# EAGLE design open-lux-N (EAGLE 6.5.0)
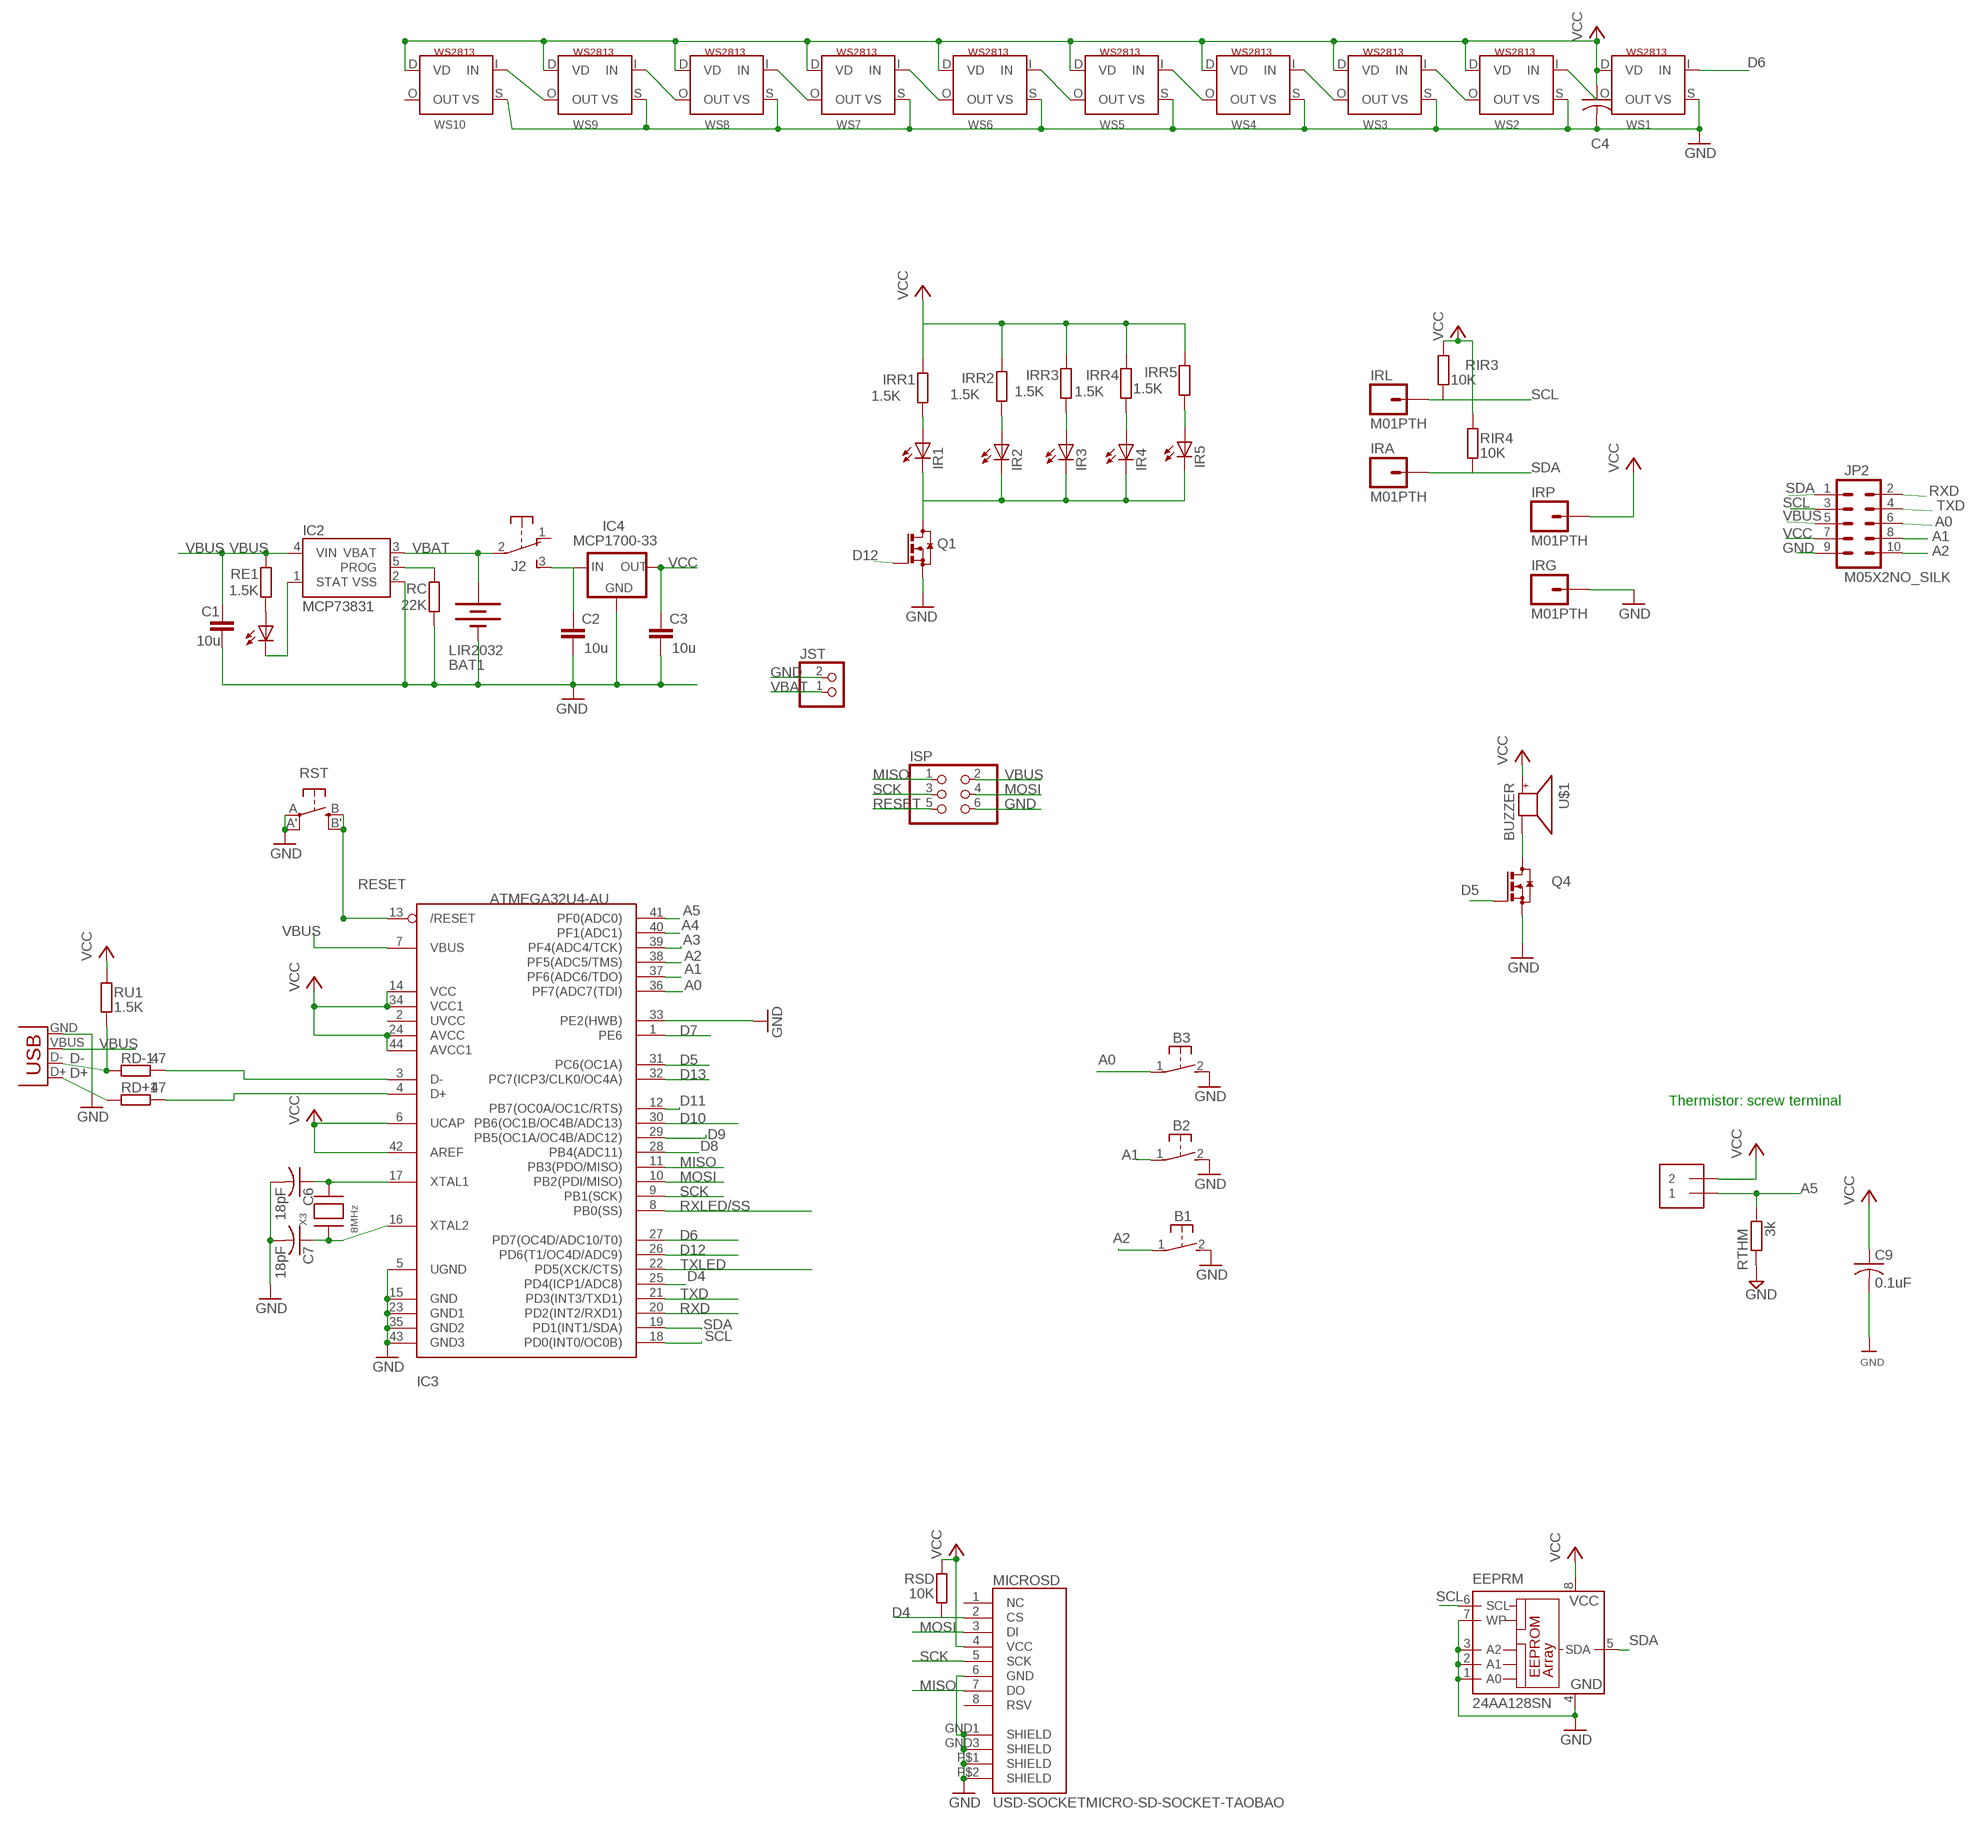
[diagram p0: schematic, sheet 1, part 1 of 2]
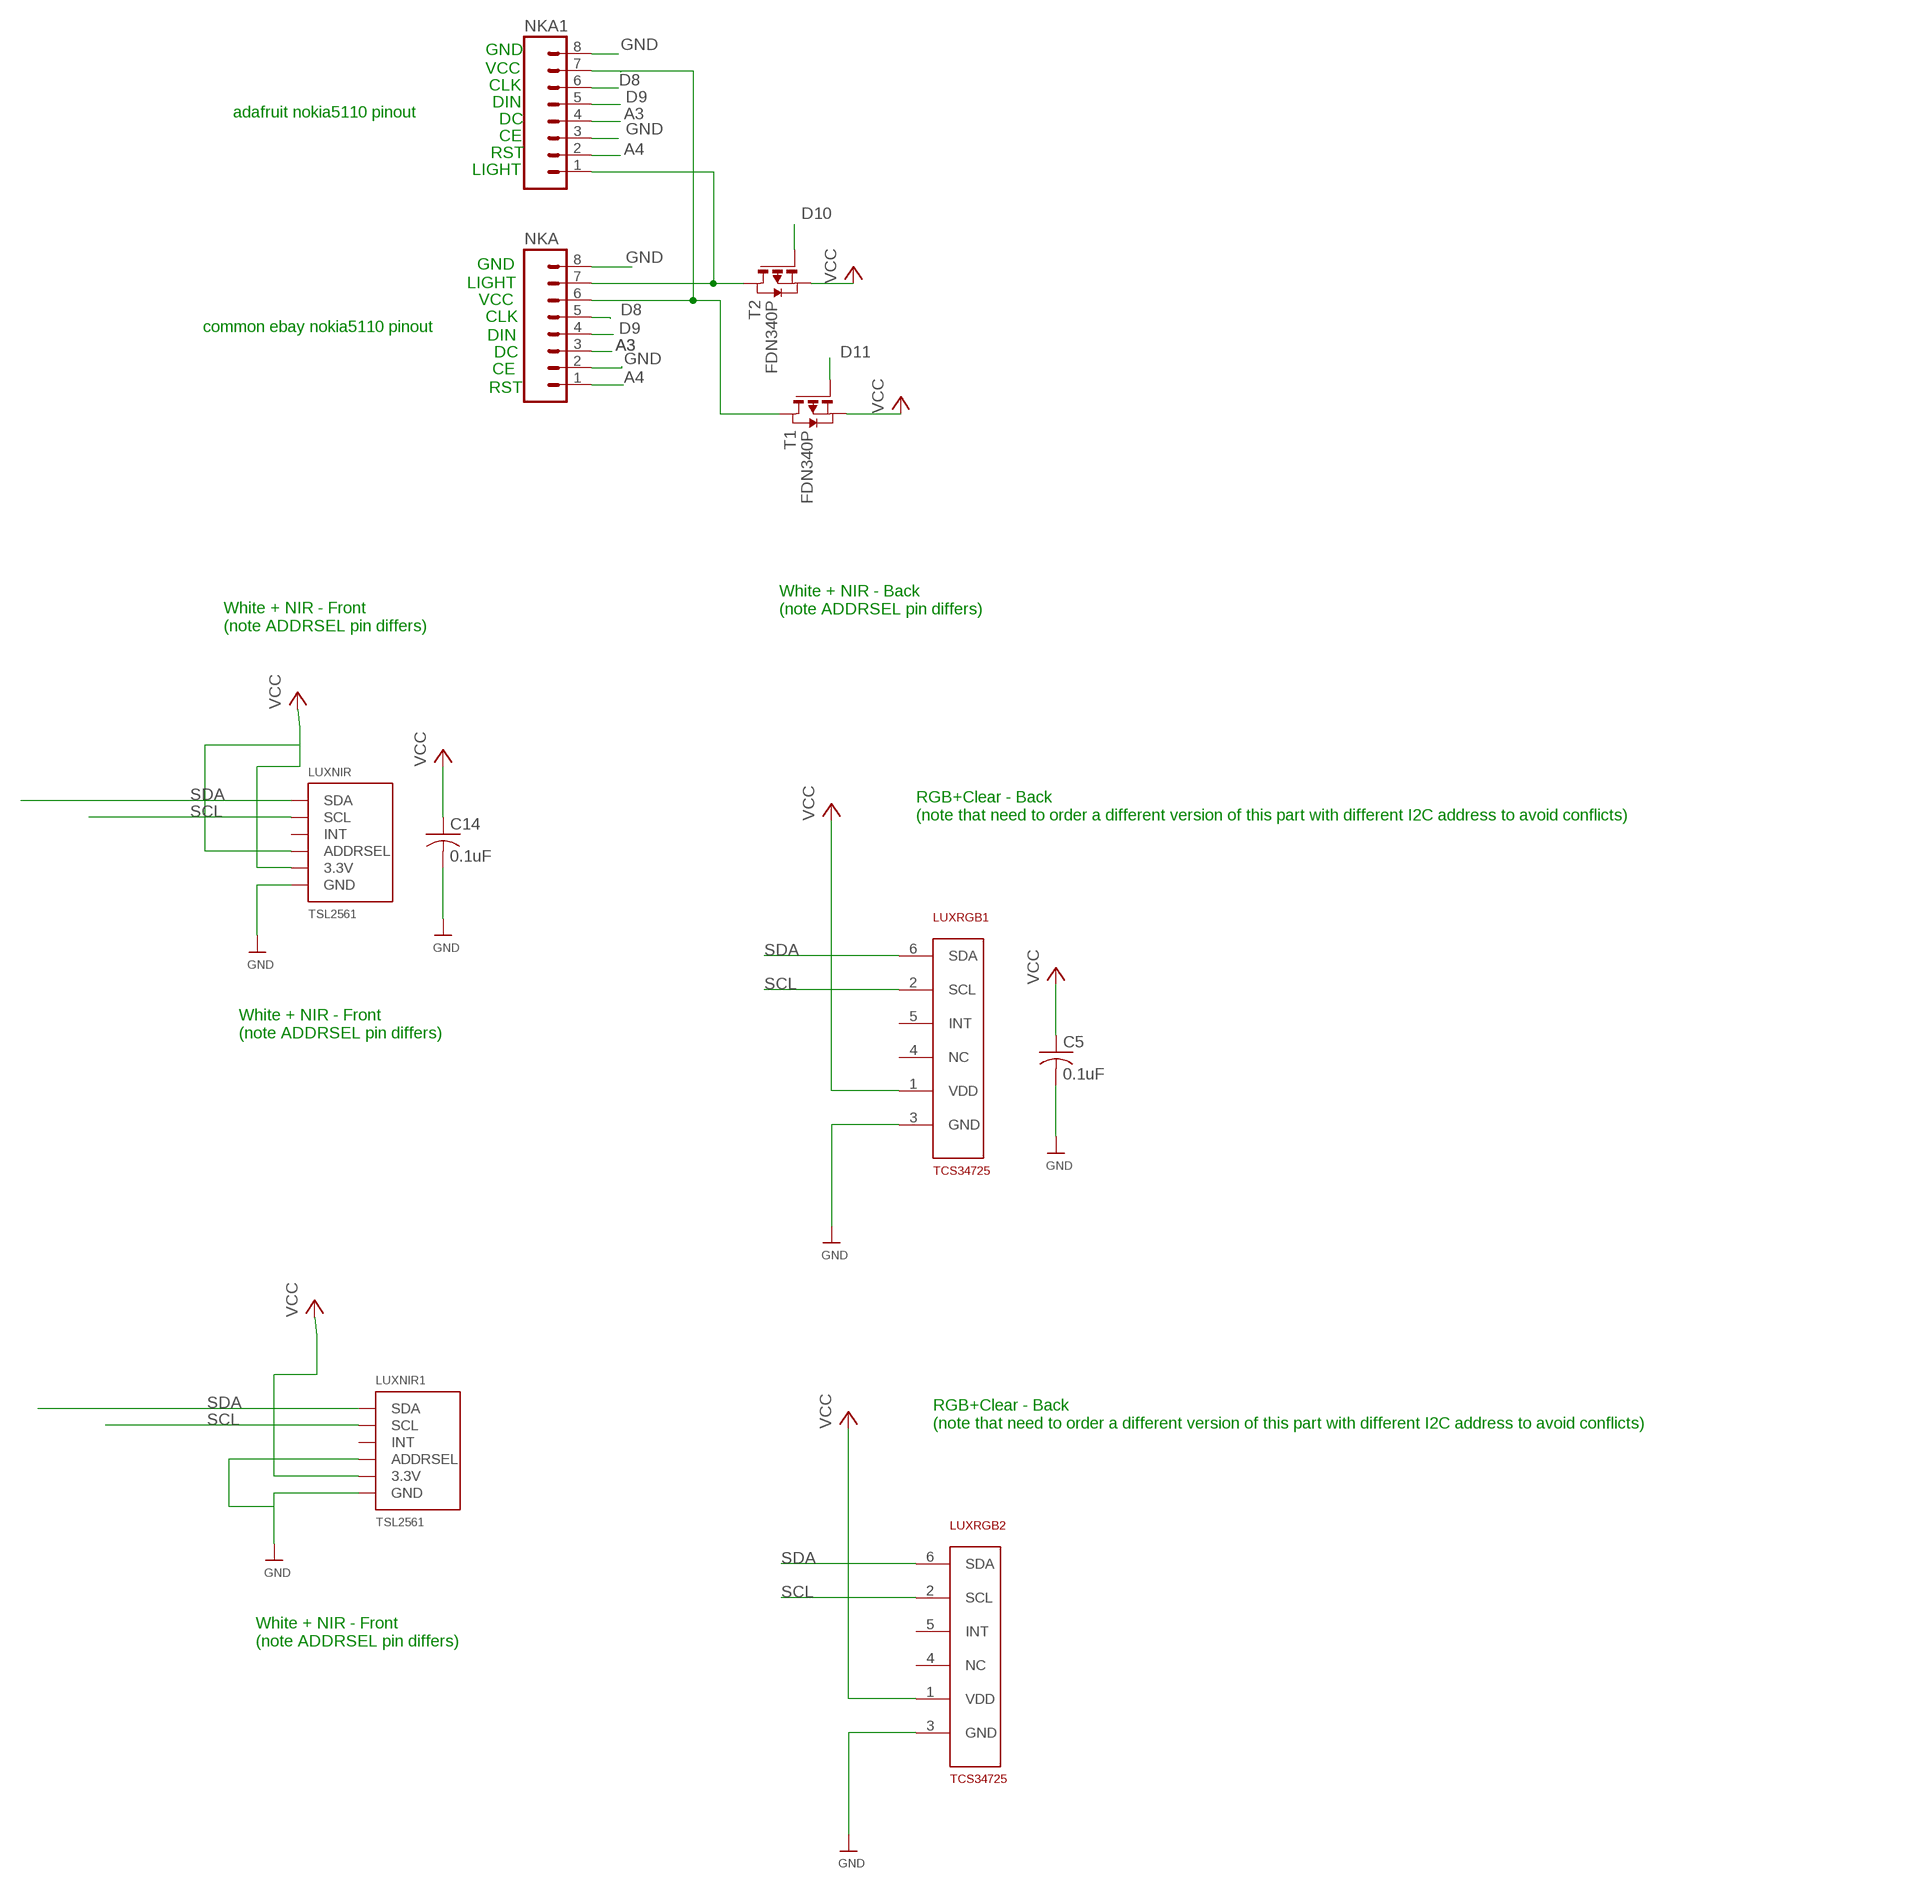
[diagram p1: schematic, sheet 1, part 2 of 2]

## Parts
B1  31-XX  [B3F-31XX]
B2  31-XX  [B3F-31XX]
B3  31-XX  [B3F-31XX]
BAT1  LIR2032  BATTERYBATTCOM_20MM_PTH_SMT  [BATTCOM_20MM_PTH_SMT]
C1  10u  C-EUC0805  [C0805]
C2  10u  C-EUC0805  [C0805]
C3  10u  C-EUC0805  [C0805]
C4  C-USC0805K  [C0805K]
C5  0.1uF  C-USC0805  [C0805]
C6  18pF  C-USC0805K  [C0805K]
C7  18pF  C-USC0805K  [C0805K]
C9  0.1uF  C-USC0805  [C0805]
C14  0.1uF  C-USC0805  [C0805]
CHARGE  0805  LEDCHIPLED_0805  [CHIPLED_0805]
EEPRM  24AA128SN  [SO-08]
IC2  MCP73831  [SOT23-5]
IC3  ATMEGA32U4-AU  [TQFP44]
IC4  MCP1700-33  MCP1700SOT233  [SOT23]
IR1  LEDCHIP-LED0603  [CHIP-LED0603]
IR2  LEDCHIP-LED0603  [CHIP-LED0603]
IR3  LEDCHIP-LED0603  [CHIP-LED0603]
IR4  LEDCHIP-LED0603  [CHIP-LED0603]
IR5  LEDCHIP-LED0603  [CHIP-LED0603]
IRA  M01PTH  [1X01]
IRG  M01PTH  [1X01]
IRL  M01PTH  [1X01]
IRP  M01PTH  [1X01]
IRR1  1.5K  R-EU_R0805  [R0805]
IRR2  1.5K  R-EU_R0805  [R0805]
IRR3  1.5K  R-EU_R0805  [R0805]
IRR4  1.5K  R-EU_R0805  [R0805]
IRR5  1.5K  R-EU_R0805  [R0805]
ISP  PINHD-2X3  [2X03]
J2  EG1206  [EG1206]
JP2  M05X2NO_SILK  [2X5_NOSILK]
JST  JST_2PIN-SMT-RA  [JST-PH-2-SMT-RA]
LUXNIR  TSL2561  [TSL2561_FN@1]
LUXNIR1  TSL2561  [TSL2561_FN@1]
LUXRGB1  TCS34725  [DFN-6]
LUXRGB2  TCS34725  [DFN-6]
MICROSD  USD-SOCKETMICRO-SD-SOCKET-TAOBAO  [MICRO-SD-SOCKET-TAOBAO]
NKA  M08LOCK  [1X08_LOCK]
NKA1  M08LOCK  [1X08_LOCK]
Q1  BSS123  [SOT23]
Q4  BSS123  [SOT23]
RC  22K  R-EU_R0805  [R0805]
RD+1  47  R-EU_R0805  [R0805]
RD-1  47  R-EU_R0805  [R0805]
RE1  1.5K  R-EU_R0805  [R0805]
RIR3  10K  R-EU_R0805  [R0805]
RIR4  10K  R-EU_R0805  [R0805]
RSD  10K  R-EU_R0805  [R0805]
RST  EVQQ2  [EVQ-Q2]
RTHM  3k  R-EU_0204/7  [0204/7]
RU1  1.5K  R-EU_R0805  [R0805]
T1  FDN340P  PMOSSOT23  [SOT-23]
T2  FDN340P  PMOSSOT23  [SOT-23]
THM1  1X2-3.5MM  [1X2-3.5MM]
U$1  BUZZER  [SMT-8585-BUZZER]
WS1  WS2813  [RGBLED5050_4]
WS2  WS2813  [RGBLED5050_4]
WS3  WS2813  [RGBLED5050_4]
WS4  WS2813  [RGBLED5050_4]
WS5  WS2813  [RGBLED5050_4]
WS6  WS2813  [RGBLED5050_4]
WS7  WS2813  [RGBLED5050_4]
WS8  WS2813  [RGBLED5050_4]
WS9  WS2813  [RGBLED5050_4]
WS10  WS2813  [RGBLED5050_4]
X2  USBSMD  [USB-MINIB]
X3  8MHz  XTALNX5032  [NX5032]

## Nets
A0: B3.1(P) IC3.36(PF7(ADC7(TDI)) JP2.6
A1: B2.1(P) IC3.37(PF6(ADC6/TDO)) JP2.8
A2: B1.1(P) IC3.38(PF5(ADC5/TMS)) JP2.10
A3: IC3.39(PF4(ADC4/TCK)) NKA1.4 NKA.3
A4: IC3.40(PF1(ADC1)) NKA1.2 NKA.1
A5: IC3.41(PF0(ADC0)) RTHM.2 THM1.1
D4: IC3.25(PD4(ICP1/ADC8)) MICROSD.2(CS) RSD.1
D5: IC3.31(PC6(OC1A)) Q4.1(G)
D6: IC3.27(PD7(OC4D/ADC10/T0)) WS1.I(IN)
D7: IC3.1(PE6)
D8: IC3.28(PB4(ADC11)) NKA1.6 NKA.5
D9: IC3.29(PB5(OC1A/OC4B/ADC12)) NKA1.5 NKA.4
D10: IC3.30(PB6(OC1B/OC4B/ADC13)) T2.3(G)
D11: IC3.12(PB7(OC0A/OC1C/RTS)) T1.3(G)
D12: IC3.26(PD6(T1/OC4D/ADC9)) Q1.1(G)
D13: IC3.32(PC7(ICP3/CLK0/OC4A))
D+: RD+1.1 X2.D+
D-: RD-1.1 RU1.1 X2.D-
GND: B1.2(S) B2.2(S) B3.2(S) BAT1.P$1(-) C1.2 C2.2 C3.2 C4.2 C5.2 C6.2 C7.2 C9.2 C14.2 EEPRM.1(A0) EEPRM.2(A1) EEPRM.3(A2) EEPRM.4(GND) EEPRM.7(WP) IC2.2(VSS) IC3.5(UGND) IC3.15(GND) IC3.23(GND1) IC3.33(PE2(HWB)) IC3.35(GND2) IC3.43(GND3) IC4.1(GND) IRG.1 ISP.6 JP2.9 JST.2 LUXNIR1.ADR(ADDRSEL) LUXNIR1.VSS(GND) LUXNIR.VSS(GND) LUXRGB1.3(GND) LUXRGB2.3(GND) MICROSD.6(GND) MICROSD.GND1(SHIELD) MICROSD.GND3(SHIELD) MICROSD.P$1(SHIELD) MICROSD.P$2(SHIELD) NKA1.3 NKA1.8 NKA.2 NKA.8 Q1.2(S) Q4.2(S) RC.1 RST.A'(P1) RST.A(P) RTHM.1 WS1.S(VS) WS2.S(VS) WS3.S(VS) WS4.S(VS) WS5.S(VS) WS6.S(VS) WS7.S(VS) WS8.S(VS) WS9.S(VS) WS10.S(VS) X2.GND
MISO: IC3.11(PB3(PDO/MISO)) ISP.1 MICROSD.7(DO)
MOSI: IC3.10(PB2(PDI/MISO)) ISP.4 MICROSD.3(DI)
N$1: C2.1 IC4.3(IN) J2.3(S)
N$2: C7.1 IC3.16(XTAL2) X3.P$1
N$3: C6.1 IC3.17(XTAL1) X3.P$2
N$4: WS9.O(OUT) WS10.I(IN)
N$5: CHARGE.C IC2.1(STAT)
N$6: IC2.5(PROG) RC.2
N$7: Q4.3(D) U$1.-
N$9: IR1.C IR2.C IR3.C IR4.C IR5.C Q1.3(D)
N$10: CHARGE.A RE1.1
N$11: IR1.A IRR1.1
N$12: NKA1.1 NKA.7 T2.1(D)
N$13: IR2.A IRR2.1
N$14: WS6.O(OUT) WS7.I(IN)
N$15: IR3.A IRR3.1
N$17: IR4.A IRR4.1
N$18: IR5.A IRR5.1
N$19: WS4.O(OUT) WS5.I(IN)
N$20: WS5.O(OUT) WS6.I(IN)
N$21: IC3.4(D+) RD+1.2
N$22: IC3.3(D-) RD-1.2
N$23: WS1.O(OUT) WS2.I(IN)
N$24: WS2.O(OUT) WS3.I(IN)
N$25: WS3.O(OUT) WS4.I(IN)
N$27: WS8.O(OUT) WS9.I(IN)
N$28: WS7.O(OUT) WS8.I(IN)
N$31: NKA1.7 NKA.6 T1.1(D)
RESET: IC3.13(/RESET) ISP.5 RST.B'(S1) RST.B(S)
RXD: IC3.20(PD2(INT2/RXD1)) JP2.2
RXLED/SS: IC3.8(PB0(SS))
SCK: IC3.9(PB1(SCK)) ISP.3 MICROSD.5(SCK)
SCL: EEPRM.6(SCL) IC3.18(PD0(INT0/OC0B)) IRL.1 JP2.3 LUXNIR1.CLK(SCL) LUXNIR.CLK(SCL) LUXRGB1.2(SCL) LUXRGB2.2(SCL) RIR3.1
SDA: EEPRM.5(SDA) IC3.19(PD1(INT1/SDA)) IRA.1 JP2.1 LUXNIR1.DATA(SDA) LUXNIR.DATA(SDA) LUXRGB1.6(SDA) LUXRGB2.6(SDA) RIR4.1
TXD: IC3.21(PD3(INT3/TXD1)) JP2.4
TXLED: IC3.22(PD5(XCK/CTS))
VBAT: BAT1.P$2(+) IC2.3(VBAT) J2.2(P) JST.1
VBUS: C1.1 IC2.4(VIN) IC3.7(VBUS) ISP.2 JP2.5 RE1.2 X2.VBUS
VCC: C3.1 C4.1 C5.1 C9.1 C14.1 EEPRM.8(VCC) IC3.6(UCAP) IC3.14(VCC) IC3.24(AVCC) IC3.34(VCC1) IC3.42(AREF) IC3.44(AVCC1) IC4.2(OUT) IRP.1 IRR1.2 IRR2.2 IRR3.2 IRR4.2 IRR5.2 JP2.7 LUXNIR1.VDD(3.3V) LUXNIR.ADR(ADDRSEL) LUXNIR.VDD(3.3V) LUXRGB1.1(VDD) LUXRGB2.1(VDD) MICROSD.4(VCC) RIR3.2 RIR4.2 RSD.2 RU1.2 T1.2(S) T2.2(S) THM1.2 U$1.+ WS1.D(VD) WS2.D(VD) WS3.D(VD) WS4.D(VD) WS5.D(VD) WS6.D(VD) WS7.D(VD) WS8.D(VD) WS9.D(VD) WS10.D(VD)
Unconnected: IC3.2(UVCC) J2.1(O) LUXNIR1.INT LUXNIR.INT LUXRGB1.4(NC) LUXRGB1.5(INT) LUXRGB2.4(NC) LUXRGB2.5(INT) MICROSD.1(NC) MICROSD.8(RSV) WS10.O(OUT)

## Notes on the sheet
- GND
- VCC
- CLK
- adafruit nokia5110 pinout | DIN
- DC
- CE
- RST
- LIGHT
- GND
- LIGHT
- VCC
- common ebay nokia5110 pinout | CLK
- DIN
- DC
- CE
- RST
- White + NIR - Back
  (note ADDRSEL pin differs)
- White + NIR - Front
  (note ADDRSEL pin differs)
- RGB+Clear - Back 
  (note that need to order a different version of this part with different I2C address to avoid conflicts)
- White + NIR - Front
  (note ADDRSEL pin differs)
- Thermistor: screw terminal
- RGB+Clear - Back 
  (note that need to order a different version of this part with different I2C address to avoid conflicts)
- White + NIR - Front
  (note ADDRSEL pin differs)

## Library data of the parts
B1-B3 = adafruit:31-XX: OMRON SWITCH Now with beefier pads!
BAT1 = SparkFunNew:BATTERY: Battery Holders Various common sizes : AA, AAA, 20mm coin cell and 12mm coin cell.
C1-C3 = resistor:C-EU: CAPACITOR, European symbol
C4 = adafruit2013:C-US: CAPACITOR, American symbol
C5-C7 C9 C14 = adafruit:C-US: CAPACITOR, American symbol
CHARGE = led:LED: LED
EEPRM = microchip:24*: Serial EEPROM I2C; MF: MICROCHIP; MPN: 24AA128-I/SN; OC_FARNELL: unknown; OC_NEWARK: 92C6842
IC2 = SparkFunNew:MCP73831: Microchip's MCP73831 Miniature single cell, fully integrated Li-Ion, Li-polymer charge management controller http://ww1.microchip.com/downloads/en/DeviceDoc/21984a.pdf
IC3 = adaprog:ATMEGA32U4
IC4 = adafruit:MCP1700: VOLTAGE REGULATOR
IR1-IR5 = adafruit:LED: LED
IRA IRG IRL IRP = SparkFun-Connectors:M01: Header 1 Standard 1-pin 0.1" header. Use with straight break away headers (SKU : PRT-00116), right angle break away headers (PRT-00553), swiss pins (PRT-00743), machine pins (PRT-00117), and female headers (PRT-00115).
IRR1-IRR5 RC RD+1 RD-1 RE1 RIR3 RIR4 RSD RTHM RU1 = rcl:R-EU_: RESISTOR, European symbol
ISP = pinhead:PINHD-2X3: PIN HEADER
J2 = adafruit:EG1206
JP2 = SparkFun-Connectors:M05X2: Header 5x2 Standard 10-pin dual row 0.1" header. Commonly used with AVR-ISP. Use with Spark Fun Electronics SKU: PRT-00778
JST = adafruit:JST_2PIN: JST 2-Pin Connectors of various flavors SMT-RA (S2B-PH-SM4) 4UConnector #17311 SMT (B2B-PH-SM4) THM-RA (S2B-PH) THM (B2B-PH)
LUXNIR LUXNIR1 = microbuilder:TSL2561: TSL2561 Light-To-Digital Sensor Mouser Part Numbers: CS (obsolete): 856-TSL2561CS DFN (cheapest): 856-TSL2561FN
LUXRGB1 LUXRGB2 = dwbLibrary:TCS34725
MICROSD = SparkFunNew:USD-SOCKET: microSD Socket Push-push type uSD socket. Schematic element and footprint production proven. Spark Fun Electronics SKU : PRT-00127. tDoc lines correctly indicate media card edge positions when inserting (unlocked, locked, depressed).
NKA NKA1 = SparkFun-Connectors:M08: Header 8 Standard 8-pin 0.1" header. Use with straight break away headers (SKU : PRT-00116), right angle break away headers (PRT-00553), swiss pins (PRT-00743), machine pins (PRT-00117), and female headers (PRT-00115).
Q1 Q4 = transistor-small-signal:BSS123: N-CHANNEL MOS FET
RST = adafruit:EVQQ2: SMT 6mm switch, EVQQ2 series http://www.ladyada.net/library/eagle
T1 T2 = zetex:PMOSSOT23: MOS FET
THM1 = adafruit:1X2: 3.5mm Terminal block http://www.ladyada.net/library/pcb/eaglelibrary.html
U$1 = adafruit:BUZZER
WS1-WS10 = adafruit:WS2813
X2 = SparkFun:USB: USB Connectors USB-B-PTH is fully proven SKU : PRT-00139 USB-miniB is fully proven SKU : PRT-00587 USB-A-PCB is untested. USB-A-H is throughly reviewed, but untested. Spark Fun Electronics SKU : PRT-00437 USB-B-SMT is throughly reviewed, but untested. Needs silkscreen touching up. USB-A-S has not been used/tested USB-MB-H has not been used/tested
X3 = adaprog:XTAL

## Net classes
1 power: width 0.813 mm, clearance 0.203 mm

## Board
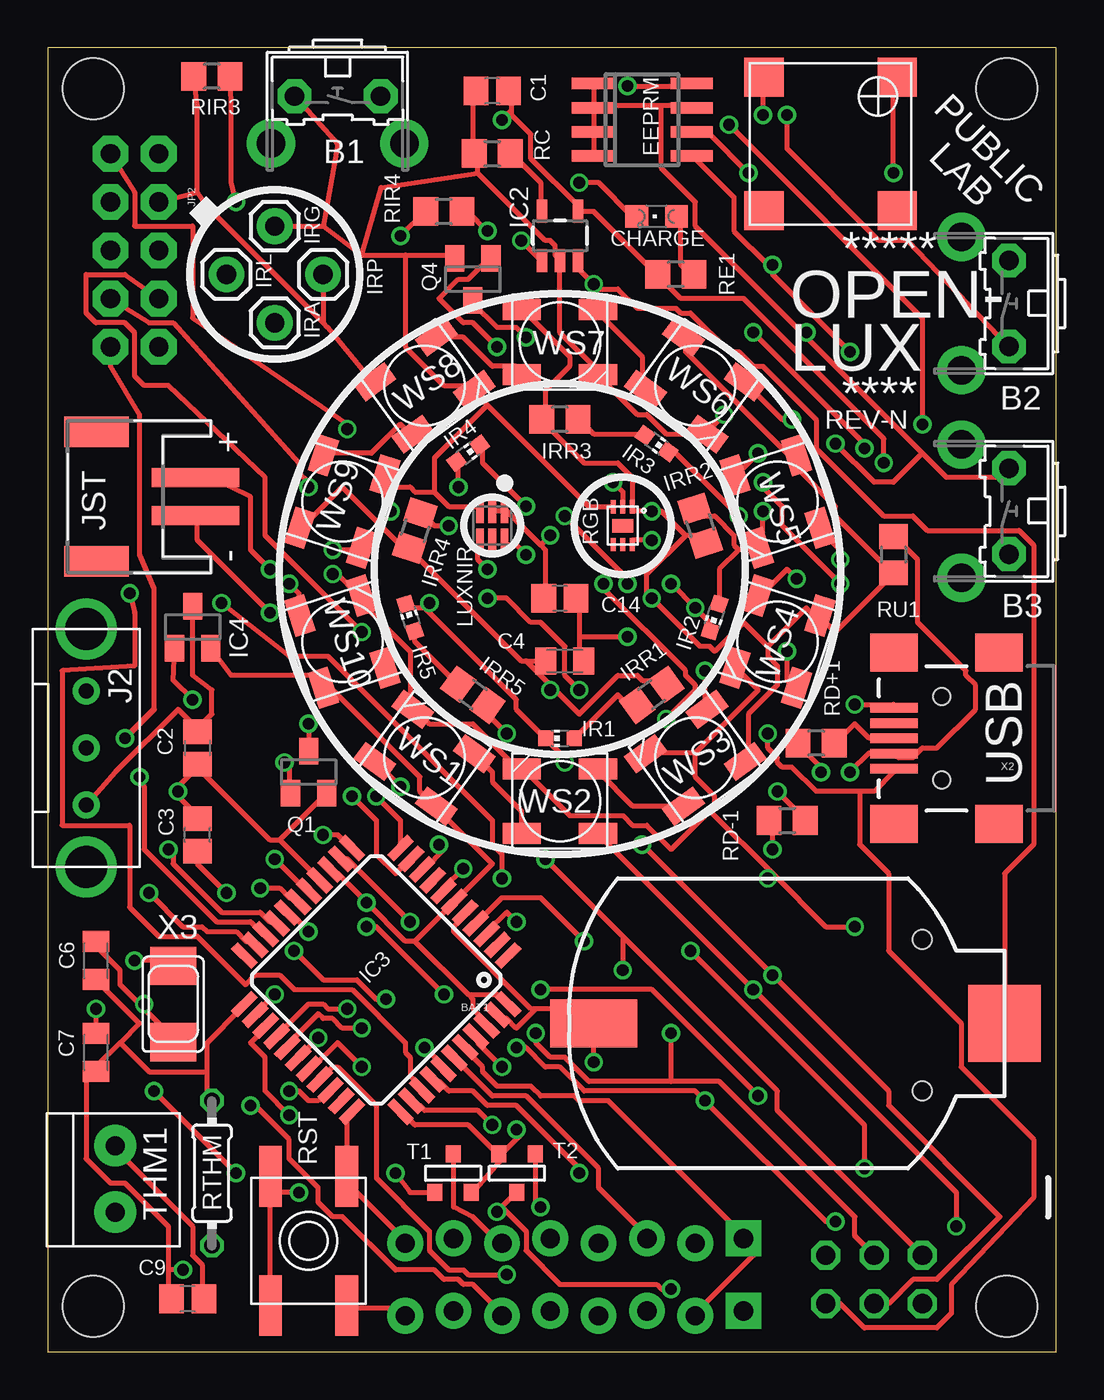
[diagram p2: board, top side]
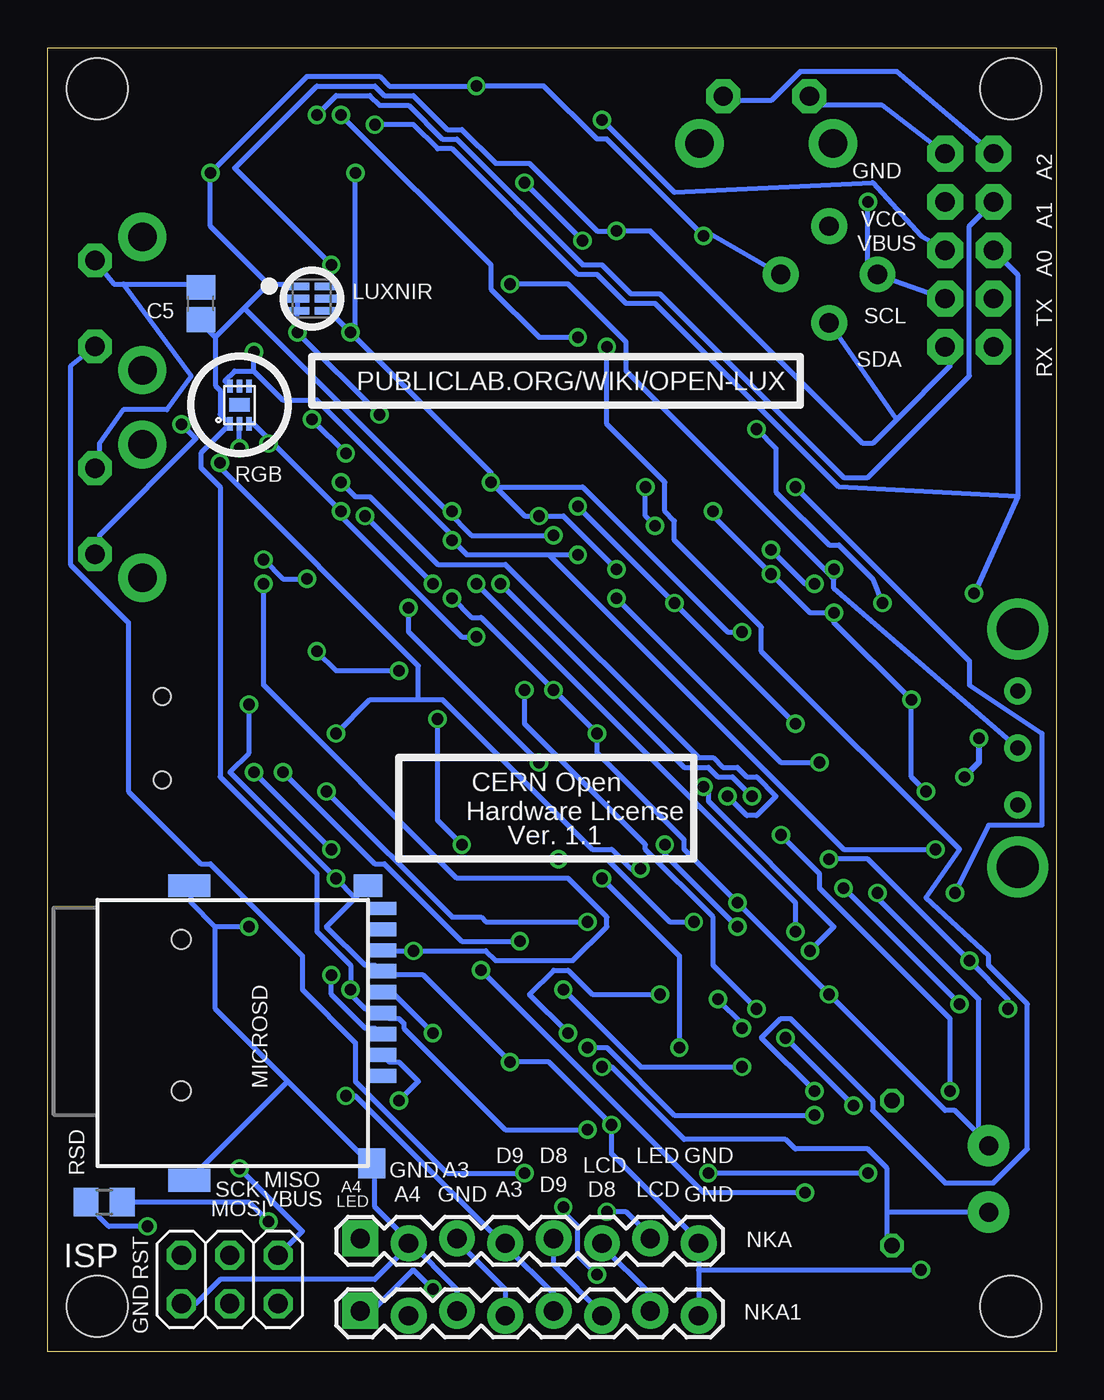
[diagram p3: board, bottom side, seen from below]

Size 53.01 x 68.57 mm. Coordinates in mm from the lower left corner, seen from the top.
Outline: 0,0 53.01,0 53.01,68.57 0,68.57 0,0
Copper layers (1*16): Top 0.0356mm / dielectric 1.5011mm / Bottom 0.0356mm
Design rules "LaenPCBOrder": minimum track width 6mil, minimum drill 13mil, track to track 6mil, track to pad 6mil, pad to pad 6mil, via to via 6mil, smd to smd 6mil, copper to edge 15mil, drill to drill 6mil, minimum pad ring 7mil, minimum via ring 7mil, stop-mask expansion 3mil, vias tented up to drill 0mil, thermal gap 10mil
Holes 3.2 mm at 2.4,66.4 50.4,2.4 50.4,66.4 2.4,2.4

### Footprints (pad centres in the part's own frame; a part is rotated, then mirrored left to right if it is on the bottom)
B3F-31XX = drill 1.016 pad 1.778 octagon: 1 -2.261,-1.245; 2 2.261,-1.245 | drill 1.499 pad 2.54: 3 -3.505,1.245; 4 3.505,1.245
BATTCOM_20MM_PTH_SMT = smd 4.572 x 2.54: P$1 0,0 | smd 3.81 x 4.064: P$2 21.59,0
C0805 = smd 1.3 x 1.5: 1 -0.85,0; 2 0.85,0
C0805K = smd 1.1 x 1.4: 1 -1,0; 2 1,0
CHIPLED_0805 = smd 1.2 x 1.2: A 0,-1.05; C 0,1.05
SO-08 = smd 0.6 x 2.2: 1 -1.905,-2.6; 2 -0.635,-2.6; 3 0.635,-2.6; 4 1.905,-2.6; 5 1.905,2.6; 6 0.635,2.6; 7 -0.635,2.6; 8 -1.905,2.6
SOT23-5 = smd 0.55 x 1.2: 1 -0.95,-1.3; 2 0,-1.3; 3 0.95,-1.3; 4 0.95,1.3; 5 -0.95,1.3
TQFP44 = smd 1.5 x 0.5: 1 -5.8,4; 2 -5.8,3.2; 3 -5.8,2.4; 4 -5.8,1.6; 5 -5.8,0.8; 6 -5.8,0; 7 -5.8,-0.8; 8 -5.8,-1.6; 9 -5.8,-2.4; 10 -5.8,-3.2; 11 -5.8,-4; 23 5.8,-4; 24 5.8,-3.2; 25 5.8,-2.4; 26 5.8,-1.6; 27 5.8,-0.8; 28 5.8,0; 29 5.8,0.8; 30 5.8,1.6; 31 5.8,2.4; 32 5.8,3.2; 33 5.8,4 | smd 0.5 x 1.5: 12 -4,-5.8; 13 -3.2,-5.8; 14 -2.4,-5.8; 15 -1.6,-5.8; 16 -0.8,-5.8; 17 0,-5.8; 18 0.8,-5.8; 19 1.6,-5.8; 20 2.4,-5.8; 21 3.2,-5.8; 22 4,-5.8; 34 4,5.8; 35 3.2,5.8; 36 2.4,5.8; 37 1.6,5.8; 38 0.8,5.8; 39 0,5.8; 40 -0.8,5.8; 41 -1.6,5.8; 42 -2.4,5.8; 43 -3.2,5.8; 44 -4,5.8
SOT23 = smd 1 x 1.4: 1 -0.95,-1.1; 2 0.95,-1.1; 3 0,1.1
CHIP-LED0603 = smd 0.8 x 0.8: A 0,-0.75; C 0,0.75
1X01 = drill 1.016 pad 1.88: 1 0,0
R0805 = smd 1.3 x 1.5: 1 -0.95,0; 2 0.95,0
2X03 = drill 1.016 octagon: 1 -2.54,-1.27; 2 -2.54,1.27; 3 0,-1.27; 4 0,1.27; 5 2.54,-1.27; 6 2.54,1.27
EG1206 = drill 0.8 pad 1.422: 1 -3,0; 2 0,0; 3 3,0 | drill 2.2: MT1 -6.25,0; MT2 6.25,0
2X5_NOSILK = drill 1.016 pad 1.88 octagon: 1 -1.27,5.08; 2 1.27,5.08; 3 -1.27,2.54; 4 1.27,2.54; 5 -1.27,0; 6 1.27,0; 7 -1.27,-2.54; 8 1.27,-2.54; 9 -1.27,-5.08; 10 1.27,-5.08
JST-PH-2-SMT-RA = smd 1 x 4.6: 1 1,-3.7; 2 -1,-3.7 | smd 1.6 x 3.4: NC1 -3.4,1.5; NC2 3.4,1.5
TSL2561_FN@1 = smd 1.3 x 0.4: ADR -0.8,0; CLK 0.8,-0.65; DATA 0.8,0.65; INT 0.8,0; VDD -0.8,0.65; VSS -0.8,-0.65
DFN-6 = smd 0.28 x 0.7: 1 -0.5,-0.988; 2 0,-0.988; 3 0.5,-0.988; 4 0.5,0.988; 5 0,0.988; 6 -0.5,0.988 | smd 1.1 x 0.7: P$1 0,0
MICRO-SD-SOCKET-TAOBAO = smd 0.75 x 1.6: 1 2.25,10.5; 2 1.15,10.5; 3 0.05,10.5; 4 -1.05,10.5; 5 -2.15,10.5; 6 -3.25,10.5; 7 -4.35,10.5; 8 -5.45,10.5 | smd 0.7 x 1.6: CD -6.55,10.5 | smd 1.2 x 1.5: GND1 -7.75,9.8 | smd 1.6 x 1.4: GND3 6.85,10 | smd 1.2 x 2.2: P$1 7.75,0.4; P$2 -7.75,0.4 | hole 1: 3.05,0; -4.93,0
1X08_LOCK = drill 1.016 pad 1.88 square: 1 0,0.127 | drill 1.016 pad 1.88: 2 2.54,-0.127; 3 5.08,0.127; 4 7.62,-0.127; 5 10.16,0.127; 6 12.7,-0.127; 7 15.24,0.127; 8 17.78,-0.127
EVQ-Q2 = smd 3.2 x 1.2: A -3.4,-2; A' 3.4,-2; B -3.4,2; B' 3.4,2
0204/7 = drill 0.813 octagon: 1 -3.81,0; 2 3.81,0
SOT-23 = smd 0.787 x 0.889: 1 0.025,-1.016; 2 -0.94,1.016; 3 0.991,1.016
1X2-3.5MM = drill 1 pad 2.184: 1 1.8,0; 2 -1.7,0
SMT-8585-BUZZER = smd 2.05 x 2.05: + -3.5,-3.5; - 3.5,-3.5; NC1 -3.5,3.5; NC2 3.5,3.5
RGBLED5050_4 = smd 2 x 1.1: D -2,1.7; I 2,1.7; O -2,-1.7; S 2,-1.7
USB-MINIB = smd 2.5 x 0.5: D+ 2.5,0; D- 2.5,0.8; GND 2.5,-1.6; ID 2.5,-0.8; VBUS 2.5,1.6 | smd 2.5 x 2: GND@1 -3,-4.5; GND@2 -3,4.5; GND@3 2.5,4.5; GND@4 2.5,-4.5 | hole 0.9: 0,2.2; 0,-2.2
NX5032 = smd 2 x 2.4: P$1 2,0; P$2 -2,0

### Placement (x,y rotation side)
B1  15.24,64.77 180 top
B2  49.28,55.12 90 top
B3  49.28,44.2 90 top
BAT1  28.7,17.27 0 top
C1  23.37,66.29 180 top
C2  7.87,31.75 270 top
C3  7.87,27.18 90 top
C4  27.18,36.32 0 top
C5  44.96,55.12 90 bottom
C6  2.54,20.57 270 top
C7  2.54,15.75 270 top
C9  7.37,2.79 180 top
C14  26.92,39.62 0 top
CHARGE  32,59.69 90 top
EEPRM  31.24,64.77 270 top
IC2  26.92,58.67 0 top
IC3  17.27,19.56 225 top
IC4  7.62,38.1 0 top
IR1  26.92,32.26 90 top
IR2  35.05,38.61 162 top
IR3  32,47.75 234 top
IR4  22.1,47.24 306 top
IR5  19.05,38.61 18 top
IRA  11.94,54.1 180 top
IRG  11.94,59.18 180 top
IRL  9.4,56.64 180 top
IRP  14.48,56.64 180 top
IRR1  31.75,34.54 36 top
IRR2  34.29,43.43 288 top
IRR3  26.92,49.02 180 top
IRR4  19.3,43.18 252 top
IRR5  22.35,34.54 324 top
ISP  43.43,3.81 180 bottom
J2  2.03,31.75 270 top
JP2  4.57,57.91 180 top
JST  4.06,44.96 90 top
LUXNIR  23.37,43.43 270 top
LUXNIR1  39.12,55.37 0 bottom
LUXRGB1  30.23,43.43 180 top
LUXRGB2  42.93,49.78 0 bottom
MICROSD  45.97,16.76 270 bottom
NKA  36.58,5.84 0 bottom
NKA1  36.58,2.03 0 bottom
Q1  13.72,30.48 0 top
Q4  22.35,56.39 180 top
RC  23.37,62.99 0 top
RD+1  40.39,32 180 top
RD-1  38.86,27.94 0 top
RE1  33.02,56.64 180 top
RIR3  8.64,67.06 180 top
RIR4  20.83,59.94 180 top
RSD  50.04,7.87 180 bottom
RST  13.72,5.84 90 top
RTHM  8.64,9.4 270 top
RU1  44.45,41.91 270 top
T1  21.34,9.4 180 top
T2  24.64,9.4 0 top
THM1  3.56,9.14 270 top
U$1  41.15,63.5 180 top
WS1  19.81,31.24 144 top
WS2  26.92,28.96 180 top
WS3  34.04,31.24 216 top
WS4  38.35,37.34 252 top
WS5  38.35,44.7 288 top
WS6  34.04,50.8 324 top
WS7  26.92,53.09 0 top
WS8  19.81,50.8 36 top
WS9  15.49,44.7 72 top
WS10  15.49,37.34 108 top
X2  46.99,32.26 180 top
X3  6.6,18.29 90 top

### Tracks (layer width: path | path; a pad name or v marks a point on that pad's centre or on a via)
A0  (via drill 0.61)
  Top 0.254: v4.32,39.88 4.57,38.86 4.57,36.07 0.76,35.81 0.76,27.69 4.32,27.69 4.32,23.37 5.84,21.84 7.87,21.84 10.41,19.3 10.92,19.81 12.19,19.81 12.95,19.05 16,19.05 18.8,16.26 18.8,15.75 19.05,15.49 19.05,14.48 19.56,13.97 IC3.36 | v45.97,48.77 45.97,54.36 v35.81,64.52
  Bottom 0.254: 2.03,44.96 2.03,56.64 JP2.6 | 2.03,44.96 v4.32,39.88 | v45.97,48.77 45.21,48.01 50.29,42.93 50.29,42.16 B3.1 | v35.81,64.52 33.78,64.52 32.51,63.25 31.75,63.25 25.15,56.64 24.13,56.64 22.61,55.12 21.08,55.12 11.43,45.47 2.03,44.96
A1  (via drill 0.61)
  Top 0.254: v27.94,9.4 27.94,9.65 24.64,12.95 23.11,12.95 22.35,13.72 21.08,13.72 20.57,14.22 20.32,14.22 IC3.37 | v38.86,65.02 38.86,63.25 43.69,58.42 45.21,58.42 B2.1
  Bottom 0.254: v27.94,9.4 32,9.4 36.83,14.22 36.83,16.26 39.62,19.05 39.62,20.83 44.45,25.65 44.96,25.65 48.77,29.46 48.77,38.35 51.82,41.4 51.82,51.82 B2.1 | JP2.8 4.57,59.18 4.57,51.31 9.91,45.97 11.18,45.97 20.83,55.63 22.35,55.63 23.88,57.15 24.89,57.15 31.5,63.75 32.26,63.75 34.04,65.53 35.56,65.53 36.07,66.04 37.85,66.04 v38.86,65.02
A2  (via drill 0.61)
  Top 0.254: v19.81,16 20.57,15.24 20.57,14.99 IC3.38 | v23.88,24.89 23.88,26.16 23.37,26.67 23.37,27.94 14.73,36.58 12.7,36.58 v9.14,39.37 | v15.75,48.51 15.75,48.77 7.62,54.36 7.62,59.18 4.57,59.18 4.57,60.96 JP2.10
  Bottom 0.254: v19.81,16 19.81,20.83 v23.88,24.89 | v9.14,39.37 9.65,40.64 11.43,42.42 11.94,42.42 14.73,45.21 14.73,47.5 v15.75,48.51 | JP2.10 8.38,67.31 13.46,67.31 14.99,65.79 17.27,65.79 B1.1
A3
  Top 0.254: IC3.39 21.59,15.24 23.37,13.46 25.15,13.46 28.96,9.65 28.96,8.64 31.5,6.1 NKA.3
  Bottom 0.254: NKA1.4 28.96,3.3 31.5,5.84 NKA.3
A4
  Top 0.254: 36.58,6.1 29.46,13.21 27.94,13.21 27.69,13.46 25.91,13.46 25.4,13.97 23.62,13.97 22.86,14.73 22.86,14.99 22.1,15.75 22.1,16 IC3.40 | 36.58,6.1 37.34,5.33 34.04,2.03 NKA1.2 | 36.58,6.1 NKA.1
A5  (via drill 0.61)
  Top 0.254: v23.88,14.99 22.61,16.26 22.61,16.51 IC3.41
  Bottom 0.254: v23.88,14.99 23.37,14.99 19.56,11.18 14.22,11.18 13.72,10.67 9.91,10.67 8.89,9.65 8.89,7.37 | 8.89,7.37 8.89,5.84 RTHM.2 | 8.89,7.37 3.56,7.37 THM1.1
D4  (via drill 0.61)
  Top 0.254: v41.4,6.86 40.89,6.86 v34.54,13.21 34.04,13.72 28.19,13.72 26.92,14.99 26.16,14.99 25.15,16 v24.64,16 | v12.7,12.45 11.43,13.72 11.43,15.49 10.67,16.26 11.43,17.02 IC3.25
  Bottom 0.254: RSD.1 42.42,7.87 v41.4,6.86 | v34.54,13.21 33.53,14.22 34.54,15.24 35.05,15.24 35.31,15.49 MICROSD.2 | v12.7,12.45 20.07,12.45 23.62,16 v24.64,16
D5  (via drill 0.61)
  Top 0.254: v23.62,52.83 22.35,54.1 21.84,54.1 20.57,55.37 21.59,56.39 22.1,56.39 23.11,57.4 Q4.1 | v12.7,13.72 13.21,13.72 13.72,13.21 14.22,13.21 14.73,13.72 IC3.31
  Bottom 0.254: v23.62,52.83 23.62,48.77 20.57,45.72 20.57,44.2 20.07,43.69 20.07,42.67 15.49,38.1 15.49,36.83 5.08,26.42 6.86,23.88 3.56,20.83 3.56,20.32 1.52,18.29 1.52,10.67 3.3,8.89 5.84,8.89 9.65,12.7 9.65,13.21 13.97,17.53 14.48,17.53 15.49,16.51 v12.7,13.72
D6  (via drill 0.61)
  Top 0.254: v16.51,17.02 15.49,17.02 14.99,17.53 14.48,17.53 14.22,17.78 12.7,16.26 IC3.27 | v17.78,18.54 17.27,18.54 16.26,19.56 14.48,19.56 v12.95,21.08 | v18.54,29.72 17.27,30.99 WS1.I
  Bottom 0.254: v16.51,17.02 16.51,17.27 v17.78,18.54 | v12.95,21.08 11.68,22.35 18.29,28.96 18.29,29.46 v18.54,29.72
D8  (via drill 0.61)
  Top 0.254: v14.22,16.51 IC3.28 | v10.67,12.95 10.92,12.95 12.7,11.18 12.7,10.16 14.22,8.64 14.22,7.87 14.99,7.11 15.49,7.11 18.29,4.32 20.32,4.32 20.83,3.81 21.59,3.81 21.84,3.56 22.35,3.56 23.88,2.03 NKA1.6
  Bottom 0.254: v10.67,12.95 v14.22,16.51 | NKA.5 26.42,4.57 23.88,2.03 NKA1.6
D9  (via drill 0.61)
  Top 0.254: v16.51,14.99 15.24,16.26 13.97,14.99 IC3.29 | v25.91,19.05 31.75,19.05 v37.34,13.46
  Bottom 0.254: v16.51,14.99 21.84,14.99 v25.91,19.05 | v37.34,13.46 36.83,13.46 28.96,5.59 | NKA1.5 26.42,3.05 28.96,5.59 | 28.96,5.59 NKA.4
D10  (via drill 0.61)
  Top 0.254: v25.91,7.62 25.65,7.87 25.65,10.41 T2.3 | v24.13,4.06 22.1,4.06 21.84,4.32 21.08,4.32 20.07,5.33 20.07,6.35 17.27,9.14 17.27,12.95 15.24,14.99 14.99,14.99 14.48,14.48 IC3.30
  Bottom 0.254: v25.91,7.62 25.91,7.37 25.15,6.6 25.15,5.08 v24.13,4.06
D11  (via drill 0.61)
  Top 0.254: T1.3 19.05,8.38 v18.29,9.4 | v5.59,13.72 v9.91,9.4 | v14.48,27.18 15.24,27.18 15.75,26.67 IC3.12
  Bottom 0.254: v9.91,9.4 v18.29,9.4 | v5.59,13.72 5.59,17.53 12.45,24.38 12.45,25.15 v14.48,27.18
D12  (via drill 0.61)
  Top 0.254: v12.45,30.99 12.7,30.73 12.7,29.46 Q1.1 | v23.11,39.62 24.13,39.62 25.4,38.35 25.91,38.35 27.18,37.08 27.18,35.56 v27.94,34.8 | v15.75,18.03 14.73,18.03 14.48,18.29 13.72,18.29 12.19,16.76 IC3.26
  Bottom 0.254: v12.45,30.99 14.48,30.99 v23.11,39.62 | v27.94,34.8 27.94,33.02 21.59,26.67 21.59,26.42 18.03,22.86 18.03,20.32 v15.75,18.03
D+
  Top 0.254: X2.D+ 43.18,32.26 42.42,33.02 41.4,32 RD+1.1
D-  (via drill 0.61)
  Top 0.254: v38.1,26.42 38.1,27.94 RD-1.1 | v42.16,30.48 43.18,31.5 44.45,31.5 X2.D- 44.7,31.24 45.47,31.24 45.97,31.75 46.74,31.75 48.77,33.78 48.77,35.05 48.26,35.56 48.26,35.81 45.72,38.35 45.72,41.66 44.7,42.67 44.45,42.67 RU1.1
  Bottom 0.254: v42.16,30.48 v38.1,26.42
GND  (via drill 0.61)
  Top 0.254: 27.94,37.59 27.94,39.62 C14.2 | 27.94,37.59 27.94,36.32 C4.2 | v37.59,44.2 37.59,42.42 WS5.S | v30.48,37.59 27.94,37.59 | EEPRM.4 28.7,62.99 28.7,64.01 EEPRM.3 28.7,64.26 28.7,65.28 EEPRM.2 28.7,65.53 | 28.7,65.53 28.7,66.55 EEPRM.1 | 28.7,65.53 32.26,65.53 | 32.26,65.53 33.78,65.53 EEPRM.7 | 32.26,65.53 32.26,62.23 34.04,60.45 34.04,59.18 39.88,53.34 | 45.97,47.24 47.24,45.97 50.04,45.97 B3.2 | 45.97,47.24 39.88,53.34 | v41.4,47.75 43.43,45.72 44.45,45.72 45.97,47.24 | 34.54,48.26 v35.56,49.28 | C1.2 22.35,66.29 22.35,62.99 RC.1 22.61,62.99 22.61,61.98 | 22.61,61.98 26.16,58.42 26.42,58.42 26.67,58.17 26.67,57.66 26.92,57.4 IC2.2 26.92,53.59 28.96,51.56 WS7.S 28.96,51.31 30.99,49.28 31.5,49.28 32.51,48.26 34.54,48.26 | 34.54,48.26 WS6.S | 20.32,45.21 21.08,44.45 22.61,44.45 LUXNIR.VSS | 20.32,45.21 19.3,45.21 19.05,45.47 18.29,45.47 17.78,45.97 | 23.11,49.78 22.35,50.55 WS8.S 22.35,50.8 20.83,50.8 18.8,52.83 18.8,57.66 | 23.11,49.78 28.45,44.45 29.72,44.45 LUXRGB1.3 | 20.32,45.21 20.32,46.99 23.11,49.78 | 14.48,59.18 16.51,57.66 | 16.51,57.66 18.8,57.66 | 18.8,57.66 21.34,57.66 Q4.2 | IRG.1 14.48,59.18 | 14.48,59.18 15.24,63.5 B1.2 | 22.61,61.98 17.53,61.21 16.51,57.66 | v39.88,53.59 39.88,53.34 | v42.42,34.04 44.45,34.04 X2.GND | 8.38,14.73 8.38,13.46 RTHM.1 | 8.38,14.73 8.38,16.26 10.16,18.03 IC3.23 | 3.81,16.26 4.83,17.27 2.54,19.56 C6.2 | 3.81,16.26 2.54,14.99 C7.2 2.54,14.73 2.03,14.22 2.03,10.16 3.3,8.89 4.06,8.89 6.35,6.6 6.35,4.32 | 6.35,4.32 6.35,2.79 C9.2 | 8.38,14.73 5.33,14.73 3.81,16.26 | 25.65,18.03 24.64,17.02 24.13,17.53 23.88,17.53 IC3.43 | 25.65,18.03 27.94,18.03 BAT1.P$1 v28.7,15.24
  Top 0.254: 25.65,18.03 25.4,18.03 21.34,22.1 21.34,22.35 21.84,22.86 IC3.5 | RST.A 15.75,2.29 18.54,2.29 18.8,2.03 NKA1.8 | IC3.33 15.75,12.45 15.75,9.4 RST.A' 15.75,9.14 15.75,8.89 18.8,5.84 NKA.8 | v23.37,11.94 22.61,12.7 19.81,12.7 19.56,12.95 19.3,12.95 IC3.35 | v7.11,4.32 6.35,4.32 | 12.19,26.92 14.48,29.21 Q1.2 | 12.19,26.92 14.22,24.89 IC3.15 | v7.62,34.29 6.6,35.31 IC4.1 | 6.86,29.21 7.87,28.19 C3.2 | 7.87,30.73 6.6,29.46 6.86,29.21 | 6.86,29.21 v6.86,29.46 | 12.19,26.92 11.68,26.92 7.87,30.73 | 7.87,30.73 C2.2 | v11.68,38.86 7.87,42.67 7.87,43.94 JST.2 | 34.04,31.5 31.5,31.5 WS3.S | 34.04,31.5 37.34,34.8 36.32,35.81 WS4.S | 34.04,31.5 34.04,30.23 35.05,29.21 35.05,28.7 34.8,28.45 | 34.8,28.45 32.77,26.42 31.5,27.69 30.73,27.69 30.23,28.19 27.43,28.19 25.15,30.48 WS2.S 24.89,30.73 24.64,30.73 22.35,33.02 20.07,33.02 19.3,33.78 WS1.S 19.05,34.04 19.05,36.83 16.26,39.62 WS10.S 16.26,39.88 15.24,40.89 v14.99,40.89 | v42.42,22.35 40.89,22.35 38.1,25.15 | 34.8,28.45 38.1,25.15 | 38.1,25.15 v37.85,24.89 | 17.78,45.97 17.78,44.45 v18.03,44.2 | 17.78,45.97 WS9.S
  Bottom 0.254: 41.15,47.75 v37.59,44.2 37.59,43.94 31.24,37.59 v30.48,37.59 | 41.15,47.75 42.16,48.77 42.42,48.77 LUXRGB2.3 | 49.02,56.13 49.53,56.13 B2.2 | 49.02,56.13 44.96,56.13 C5.2 | 49.02,56.13 45.47,51.31 46.74,49.53 49.02,49.53 50.29,47.75 50.29,46.48 B3.2 | v41.4,47.75 41.15,47.75 | LUXNIR1.ADR 39.88,55.37 39.88,54.86 LUXNIR1.VSS 39.88,54.61 v39.88,53.59 v35.56,49.28 | JP2.9 9.14,65.53 12.95,65.53 B1.2 | 36.83,23.88 38.35,22.35 36.32,20.32 35.81,20.32 35.56,20.07 MICROSD.6 35.31,19.81 33.27,19.81 v28.7,15.24 26.67,15.24 v23.37,11.94 23.37,10.41 18.8,5.84 NKA.8 18.8,4.32 | 36.83,23.88 36.32,24.38 MICROSD.GND1 | v42.42,34.04 42.42,31.5 43.43,30.48 v37.85,24.89 36.83,23.88 | 18.8,4.32 NKA1.8 | 18.8,4.32 v7.11,4.32 | 34.04,5.84 35.81,7.62 35.81,9.91 MICROSD.GND3 36.07,9.91 40.39,14.22 | 40.39,14.22 45.47,9.14 MICROSD.P$1 | 44.2,22.35 45.47,23.62 45.47,24.38 MICROSD.P$2 | 44.2,22.35 44.2,18.03 40.39,14.22 | ISP.6 45.21,2.54 43.94,3.81 35.81,3.81 34.04,5.59 NKA.2 34.04,5.84 | NKA1.3 31.5,3.3 34.04,5.84 | v6.86,29.46 7.62,30.23 v7.62,34.29 11.68,38.35 v11.68,38.86 12.95,38.86 v14.99,40.89 18.03,43.94 v18.03,44.2 | v42.42,22.35 44.2,22.35
MISO  (via drill 0.61)
  Top 0.254: v17.27,29.21 18.54,27.94 18.54,26.67 IC3.11 | v37.59,45.72 37.59,45.47 38.61,44.45 38.61,43.43 v41.66,40.39 | v42.93,9.65 42.93,11.94 v33.78,21.08
  Bottom 0.254: v17.27,29.21 16.26,28.19 15.75,28.19 14.73,29.21 15.75,30.23 16.26,30.23 16.76,30.73 17.53,30.73 18.03,31.24 18.8,31.24 28.96,41.4 32.51,41.4 36.07,44.96 36.83,44.96 v37.59,45.72 | v41.66,40.39 41.66,35.05 31.5,24.89 25.65,24.89 23.62,22.86 23.62,22.35 25.4,20.57 29.46,20.57 29.97,21.08 v33.78,21.08 35.31,21.08 MICROSD.7 | ISP.1 39.62,6.35 v42.93,9.65
MOSI  (via drill 0.61)
  Top 0.254: v16,29.21 17.27,27.94 17.27,26.16 18.29,25.15 19.05,25.91 IC3.10 | v29.21,40.39 29.21,40.13 33.53,35.81 33.53,35.56 34.04,35.05 34.04,34.8 v32.51,33.27 | v31.24,26.67 v38.1,19.81 44.2,13.72 44.2,12.95 50.04,7.11 46.74,3.81 45.47,3.81 44.2,2.54 ISP.4
  Bottom 0.254: v16,29.21 17.02,30.23 17.78,30.23 18.29,30.73 19.56,30.73 v29.21,40.39 | v32.51,33.27 32.51,27.94 v31.24,26.67 | v38.1,19.81 38.1,18.8 36.32,17.02 35.81,17.02 35.56,16.76 MICROSD.3
N$1
  Top 0.254: IC4.3 7.62,35.56 8.64,34.8 8.64,33.53 7.87,32.77 | J2.3 3.56,30.48 6.86,33.78 7.87,32.77 | 7.87,32.77 C2.1
N$2  (via drill 0.61)
  Top 0.254: v2.54,18.03 C7.1 | v4.57,20.57 6.35,20.57 6.6,20.32 X3.P$1 | v11.94,25.91 13.46,24.38 13.72,24.38 IC3.16
  Bottom 0.254: v2.54,18.03 2.54,18.54 v4.57,20.57 9.91,25.91 v11.94,25.91
N$3  (via drill 0.61)
  Top 0.254: 4.83,18.29 6.6,16.51 X3.P$2 | 4.83,18.29 3.81,19.3 3.81,20.07 2.54,21.34 C6.1 | v11.18,24.38 12.19,24.38 12.7,23.88 12.95,23.88 IC3.17 | 4.83,18.29 v5.08,18.29
  Bottom 0.254: v5.08,18.29 v11.18,24.38
N$4  (via drill 0.61)
  Top 0.254: v12.7,40.39 13.21,39.88 13.21,38.86 WS10.I | v14.99,42.16 16.26,42.16 WS9.O
  Bottom 0.254: v12.7,40.39 13.21,40.39 v14.99,42.16
N$5  (via drill 0.61)
  Top 0.254: v24.89,58.42 25.91,57.4 IC2.1 | v27.94,61.47 28.96,61.47 30.73,59.69 CHARGE.C
  Bottom 0.254: v27.94,61.47 v24.89,58.42
N$6
  Top 0.254: IC2.5 25.91,60.2 25.91,61.47 24.38,62.99 RC.2
N$7  (via drill 0.61)
  Top 0.254: v25.15,53.34 24.64,53.85 23.62,53.85 22.35,55.12 Q4.3 | v37.59,65.02 37.59,66.8 U$1.-
  Bottom 0.254: v25.15,53.34 27.18,53.34 29.72,55.88 29.72,57.15 v37.59,65.02
N$9  (via drill 0.61)
  Top 0.254: v32.77,40.39 v34.04,39.12 34.8,38.35 34.8,38.1 IR2.C | v36.32,43.94 32.77,47.5 IR3.C | 19.81,39.12 19.05,39.12 IR5.C | 19.81,39.12 24.64,34.29 24.64,33.78 IR1.C | v25.15,44.45 22.86,46.74 22.86,47.5 IR4.C | 19.81,39.12 v20.07,39.37 | v13.72,33.02 Q1.3 | v27.18,30.99 27.18,31.24 IR1.C | IR1.C
  Bottom 0.254: v36.32,43.94 v32.77,40.39 | v25.15,44.45 v20.07,39.37 v13.72,33.02 | v34.04,39.12 34.04,37.85 v27.18,30.99
N$10
  Top 0.254: CHARGE.A 33.27,59.69 33.27,57.15 33.78,56.64 RE1.1
N$11
  Top 0.254: IR1.A 27.69,32.26 29.97,34.54 30.73,33.78 IRR1.1
N$12  (via drill 0.61)
  Top 0.254: 23.88,7.62 24.64,8.38 T2.1 | v32.77,3.3 32.26,3.3 32,3.56 26.92,3.56 25.15,5.33 25.15,6.35 23.88,7.62 | 23.88,7.62 v23.62,7.37
  Bottom 0.254: v23.62,7.37 22.61,7.37 21.34,6.1 NKA.7 | v32.77,3.3 33.78,4.32 35.81,2.29 36.58,2.29 NKA1.1
N$13
  Top 0.254: IR2.A 35.31,39.37 35.31,41.15 36.32,42.16 36.07,42.42 36.07,42.93 35.05,43.94 34.29,43.94 34.04,44.2 IRR2.1
N$14
  Top 0.254: WS6.O 31.24,50.8 31.24,52.32 28.96,54.61 WS7.I
N$15
  Top 0.254: IR3.A 31.24,48.26 28.7,48.26 27.94,49.02 IRR3.1
N$17  (via drill 0.61)
  Top 0.254: v21.59,45.47 21.59,46.74 IR4.A | v21.08,43.43 20.32,43.43 19.81,43.94 IRR4.1
  Bottom 0.254: v21.59,45.47 21.59,43.94 v21.08,43.43
N$18
  Top 0.254: IR5.A 19.3,37.85 19.3,37.34 21.34,35.31 IRR5.1
N$19  (via drill 0.61)
  Top 0.254: v39.37,40.64 38.86,41.15 37.59,39.88 WS4.O | v41.66,41.66 41.66,42.16 40.64,43.18 WS5.I
  Bottom 0.254: v39.37,40.64 40.64,40.64 v41.66,41.66
N$20  (via drill 0.61)
  Top 0.254: v37.34,47.24 36.32,46.23 WS5.O | v39.12,49.02 38.61,49.02 36.83,50.8 WS6.I
  Bottom 0.254: v39.12,49.02 v37.34,47.24
N$21  (via drill 0.61)
  Top 0.254: v28.19,21.59 25.91,23.88 23.88,23.88 22.61,22.61 IC3.4 | v40.64,30.48 40.64,30.73 39.37,32 RD+1.2
  Bottom 0.254: v28.19,21.59 31.24,21.59 35.31,25.65 35.81,25.65 v40.64,30.48
N$22  (via drill 0.61)
  Top 0.254: v24.64,22.61 24.13,23.11 23.11,22.1 IC3.3 | v38.35,29.46 39.88,27.94 RD-1.2
  Bottom 0.254: v24.64,22.61 29.97,22.61 30.23,22.86 31.75,22.86 v38.35,29.46
N$23
  Top 0.254: WS2.I 24.89,27.43 24.89,28.45 23.37,29.97 23.37,30.48 22.61,31.24 WS1.O
N$24
  Top 0.254: WS3.I 33.27,28.7 30.73,28.7 28.96,30.48 WS2.O
N$25  (via drill 0.61)
  Top 0.254: v34.54,35.81 34.54,34.04 WS3.O | v38.86,36.83 38.86,35.31 39.12,35.05 WS4.I
  Bottom 0.254: v34.54,35.81 37.85,35.81 v38.86,36.83
N$27
  Top 0.254: WS9.I 14.73,47.24 17.02,47.24 18.54,48.77 19.05,48.26 WS8.O
N$28
  Top 0.254: WS8.I 20.57,53.34 21.84,53.34 23.37,51.82 24.64,51.82 24.89,51.56 WS7.O
N$31
  Top 0.254: T1.1 21.34,10.67 21.34,7.62 22.35,7.11 23.88,5.59 NKA.6
  Bottom 0.254: NKA1.7 21.34,3.05 23.88,5.59 NKA.6
RESET  (via drill 0.61)
  Top 0.254: 11.68,8.38 11.68,9.14 RST.B' 11.68,8.38 | 11.68,8.38 11.68,2.54 RST.B | v19.05,22.61 15.75,25.91 15.49,25.91 IC3.13 | 30.23,21.84 38.35,13.72 38.35,12.7 ISP.5 | 30.23,21.84 v26.16,25.91 | v13.21,8.38 11.68,8.38 | 30.23,21.84 v30.23,20.07
  Bottom 0.254: v19.05,22.61 20.32,22.61 23.62,25.91 v26.16,25.91 | v13.21,8.38 18.54,8.38 v30.23,20.07
RXD  (via drill 0.6 pad 0.25)
  Top 0.254: 5.59,33.78 5.59,40.13 4.83,41.91 4.83,49.28 3.3,51.82 JP2.2 | IC3.20 11.43,22.1 11.18,22.1 10.67,22.61 8.89,22.61 5.08,26.42 5.08,29.72 v4.83,30.23
  Top 0.305: 5.59,33.78 v4.06,32.26
  Bottom 0.305: v4.06,32.26 4.06,30.99 v4.83,30.23
SCK  (via drill 0.61)
  Top 0.254: v20.57,26.67 20.83,26.42 19.81,25.4 IC3.9 | v16.76,22.35 17.27,22.35 v20.83,18.8 | v25.65,16.76 25.65,16.26 26.42,15.49 27.18,15.49 28.45,14.22 32.77,14.22 | 32.77,14.22 35.31,14.22 42.42,7.11 42.42,6.1 ISP.3 | 32.77,14.22 v32.77,16.76
  Bottom 0.254: v20.57,26.67 20.57,26.16 v16.76,22.35 | v20.83,18.8 24.38,18.8 25.65,20.07 26.42,20.07 27.69,18.8 v25.65,16.76 | v32.77,16.76 34.8,18.8 35.31,18.8 MICROSD.5
SCL  (via drill 0.61)
  Top 0.254: v9.91,60.45 9.65,61.47 9.65,65.79 RIR3.1 | LUXRGB1.2 30.23,45.21 v29.72,45.72 | v42.93,47.5 42.93,47.75 v37.08,53.59 | v23.11,41.15 22.61,41.66 22.61,42.42 LUXNIR.CLK | v13.72,22.1 12.95,22.86 12.7,22.86 IC3.18 | v30.48,40.39 30.48,40.64 v27.18,43.94 | v36.83,61.98 34.8,64.01 34.04,64.01 EEPRM.6 | JP2.3 4.06,56.64 2.03,56.64 2.03,54.61 2.54,54.1 4.06,54.1 4.57,53.59 4.57,51.31 5.08,50.8 6.35,50.8 11.43,45.97 11.43,42.93 v16.51,37.85
  Bottom 0.254: v9.91,60.45 9.91,57.15 IRL.1 JP2.3 | 36.83,53.34 29.72,46.23 v29.72,45.72 29.46,45.47 | LUXNIR1.CLK 38.1,54.61 v37.08,53.59 36.83,53.34 | v42.93,47.5 LUXRGB2.2 | v23.11,41.15 25.91,43.94 v27.18,43.94 27.94,43.94 29.46,45.47 | v13.72,22.1 13.72,23.62 v30.48,40.39 | 36.83,53.34 v36.83,61.98 | v16.51,37.85 17.27,37.85 24.89,45.47 29.46,45.47
SDA  (via drill 0.61)
  Top 0.254: RIR4.1 22.1,59.94 v23.11,58.93 | EEPRM.5 34.04,62.74 36.07,60.71 36.07,58.93 37.85,57.15 v38.1,57.15 38.1,56.64 v42.16,52.58 | v31.75,42.67 30.73,42.67 LUXRGB1.6 | v25.15,41.91 24.64,42.42 24.13,42.42 LUXNIR.DATA | v6.35,26.42 6.6,26.16 6.6,25.65 9.14,23.11 11.18,23.11 11.68,22.61 11.94,22.61 IC3.19
  Bottom 0.254: 8.38,49.02 5.59,51.82 JP2.1 | 8.38,49.02 9.65,47.75 10.16,47.75 21.34,58.93 v23.11,58.93 24.13,58.93 27.69,62.48 29.46,62.48 31.24,64.26 32,64.26 33.78,66.04 35.31,66.04 35.81,66.55 38.86,66.55 43.18,62.23 v38.1,57.15 38.1,56.13 LUXNIR1.DATA | 8.38,49.02 IRA.1 | 42.16,51.56 40.64,50.04 38.86,50.04 31.75,42.93 v31.75,42.67 30.99,41.91 26.67,41.91 | 42.16,51.56 43.18,51.56 43.69,51.05 43.43,50.8 LUXRGB2.6 | 26.67,41.91 v25.15,41.91 | v6.35,26.42 11.18,26.42 26.67,41.91 | 42.16,51.56 v42.16,52.58
TXD  (via drill 0.61)
  Top 0.254: v5.33,24.13 7.11,22.35 8.13,22.35 8.38,22.1 9.91,22.1 10.41,21.59 10.67,21.59 IC3.21 | v13.72,45.47 13.72,45.72 13.21,46.23 13.21,46.74 6.6,54.1 5.33,54.1 JP2.4
  Bottom 0.254: v5.33,24.13 3.56,27.69 0.76,27.69 0.76,32.51 4.57,35.05 4.57,36.32 v13.72,45.47
VBAT  (via drill 0.61)
  Top 0.254: IC2.3 27.94,57.15 27.94,56.9 v28.7,56.13 28.96,55.88 29.97,55.88 30.99,54.86 33.02,54.86 33.27,54.61 33.78,54.61 35.81,52.58 36.32,52.58 37.08,51.82 37.59,51.82 40.39,49.02 40.39,47.5 43.94,43.94 45.47,43.94 46.23,43.18 51.05,43.18 51.82,42.42 51.82,26.67 50.29,25.15 BAT1.P$2 | v11.68,41.15 10.67,42.16 10.67,44.96 8.64,45.97 7.11,45.97 JST.1
  Bottom 0.254: v28.7,56.13 25.65,56.13 22.61,53.09 22.61,51.56 11.94,40.89 | 11.94,40.89 11.68,40.64 11.68,40.13 J2.2 | 11.94,40.89 v11.68,41.15
VBUS  (via drill 0.61)
  Top 0.254: 24.38,65.28 24.38,65.02 25.4,64.01 25.4,62.74 27.94,60.2 IC2.4 27.94,59.94 28.7,59.94 32,56.64 RE1.2 32.26,56.64 32.26,56.39 33.27,55.37 36.58,55.37 43.94,48.01 v43.94,46.74 | 24.38,65.28 24.38,66.29 C1.1 | 24.38,65.28 v23.88,64.77 | v21.84,25.4 20.83,24.38 IC3.7 | v37.85,32.51 37.85,31.75 38.35,31.24 38.35,30.99 38.61,30.73 39.12,30.73 40.39,29.46 42.67,29.46 | 42.67,29.46 43.43,29.46 44.45,30.48 X2.VBUS | ISP.2 41.66,2.54 42.93,1.27 46.74,1.27 47.5,2.03 47.5,3.56 51.82,8.13 51.82,11.18 48.01,14.99 48.01,17.27 44.2,21.08 44.2,25.15 42.67,26.67 42.67,29.46
  Bottom 0.254: JP2.5 7.11,58.67 9.65,61.47 20.07,60.96 v23.88,64.77 | v21.84,25.4 22.35,25.4 23.37,26.42 24.38,26.42 32.26,34.29 33.53,34.29 | 33.53,34.29 36.07,34.29 v37.85,32.51 | v43.94,46.74 43.94,46.48 33.53,36.07 33.53,34.29
VCC  (via drill 0.61)
  Top 0.254: IC4.2 9.65,35.56 13.97,35.56 14.48,35.05 WS10.D 14.73,34.8 14.99,34.8 19.56,30.23 19.56,29.46 20.32,28.7 WS1.D 20.57,28.45 23.37,25.65 IC3.6 19.3,21.59 | 19.3,21.59 18.8,21.59 v16.76,23.62 15.24,25.15 14.99,25.15 IC3.14 | 19.3,21.59 22.1,18.8 | 22.1,18.8 22.35,18.54 22.35,18.03 22.86,17.53 22.86,17.27 IC3.42 | 22.1,18.8 23.62,18.8 24.13,18.29 IC3.44 | 25.15,36.32 24.89,36.32 19.05,42.16 IRR4.2 18.8,42.16 15.49,45.47 13.46,43.43 WS9.D | 25.15,36.32 C4.1 | 25.15,36.32 26.42,35.05 | 26.42,35.05 27.94,33.53 29.97,35.56 30.99,35.56 31.24,35.31 32.51,35.31 IRR1.2 | C9.1 8.13,2.79 8.13,4.57 7.62,5.08 7.62,6.6 3.56,10.67 THM1.2 | v11.94,18.8 10.92,17.78 IC3.24 | C3.1 7.87,25.65 v9.4,24.13 | v24.13,32.51 23.37,33.27 23.37,33.78 IRR5.2 | v26.42,34.8 26.42,35.05 | 23.62,10.41 23.88,10.16 22.35,8.38 T1.2 | 23.62,10.41 22.1,11.94 19.3,11.94 18.8,12.45 IC3.34 | 23.62,10.41 T2.2 23.88,10.41 24.89,11.43 v24.64,11.68 | v47.75,6.6 47.75,8.38 v37.08,19.05 28.96,27.18 WS2.D | 7.87,60.96 7.87,65.53 RIR3.2 | JP2.7 7.87,60.96 | v18.54,58.67 19.81,59.94 RIR4.2 | IRP.1 14.48,54.1 | WS8.D 17.02,51.05 14.73,53.85 14.48,54.1 | v30.48,66.55 33.78,66.55 EEPRM.8 | 7.87,60.96 8.38,60.2 14.48,54.1 | 33.53,42.93 32.26,44.2 v31.75,44.2 30.73,44.2 LUXRGB1.1 30.73,44.45 30.73,45.97 29.97,46.74 28.19,46.74 25.91,49.02 IRR3.2 26.16,49.02 26.16,50.55 27.43,51.82 27.43,52.32 25.15,54.61 WS7.D | 33.53,42.93 34.29,42.93 34.54,42.67 IRR2.2 | 44.45,40.89 41.4,37.85 40.64,38.61 WS4.D 40.39,38.61 39.88,39.12 37.85,37.08 | 37.85,37.08 37.85,36.58 38.35,36.07 38.35,35.05 36.83,33.53 36.83,31.24 WS3.D | 44.45,40.89 41.4,43.94 41.4,44.45 39.37,46.48 39.37,46.99 WS5.D 39.12,46.99 33.53,52.58 33.53,53.34 WS6.D
  Top 0.254: 44.45,40.89 RU1.2 | 33.53,42.93 31.5,40.89 31.5,39.88 v31.75,39.62 34.29,37.08 34.8,37.08 35.05,36.83 36.58,38.35 37.85,37.08 | LUXNIR.ADR 23.37,44.2 23.88,44.2 LUXNIR.VDD 24.13,44.2 25.91,42.42 | 25.91,42.42 26.16,42.16 26.16,39.62 C14.1 | v44.45,61.98 44.45,66.8 U$1.+ | v26.42,42.93 25.91,42.42
  Bottom 0.254: 4.06,11.43 3.56,10.92 THM1.2 4.06,11.43 | 4.06,11.43 5.33,12.7 5.84,12.7 v11.94,18.8 v16.76,23.62 19.56,26.42 19.56,26.92 24.13,31.5 v24.13,32.51 v26.42,34.8 30.23,38.61 30.73,38.61 v31.75,39.62 | v9.4,24.13 9.4,23.88 4.06,18.54 4.06,11.43 | v47.75,6.6 49.78,6.6 50.8,7.62 50.8,7.87 RSD.2 | v24.64,11.68 28.96,11.68 34.29,17.02 34.29,17.27 34.54,17.53 35.05,17.53 35.31,17.78 MICROSD.4 35.56,18.03 36.32,18.03 37.08,18.8 v37.08,19.05 37.08,20.32 38.86,22.1 38.86,25.15 43.94,30.23 43.94,45.47 44.96,46.48 44.96,47.24 43.43,48.77 LUXRGB2.1 43.43,49.02 43.69,49.02 43.94,49.28 43.94,50.55 44.2,50.8 44.2,53.34 | IRP.1 18.03,58.67 v18.54,58.67 23.62,63.75 24.13,63.75 26.92,66.55 v30.48,66.55 35.05,66.55 35.56,67.06 39.37,67.06 v44.45,61.98 44.45,59.18 41.4,56.13 | 44.2,53.34 44.96,54.1 C5.1 | 41.4,56.13 40.13,56.13 LUXNIR1.VDD | 44.2,53.34 42.67,54.86 | 42.67,54.86 41.4,56.13 | v26.42,42.93 30.73,42.93 32,44.2 | 42.67,54.86 32,44.2 | 32,44.2 v31.75,44.2

### Text on the board
tNames: PUBLIC | LAB | ***** | OPEN- | LUX | **** | REV-N | RGB | LUXNIR | USB
bNames: A2 | GND | A1 | VCC | VBUS | A0 | LUXNIR | TX | SCL | RX | SDA | PUBLICLAB.ORG/WIKI/OPEN-LUX | RGB | CERN Open | Hardware License | Ver. 1.1 | GND | LED | D8 | D9 | LCD | A3 | GND | MISO | GND | LCD | D8 | D9 | A3 | GND | A4 | A4 | LED | VBUS | SCK | MOSI | RST | GND